# Altium schematic sheet IMX6ULL_CORE_sch5.SchDoc
size A4
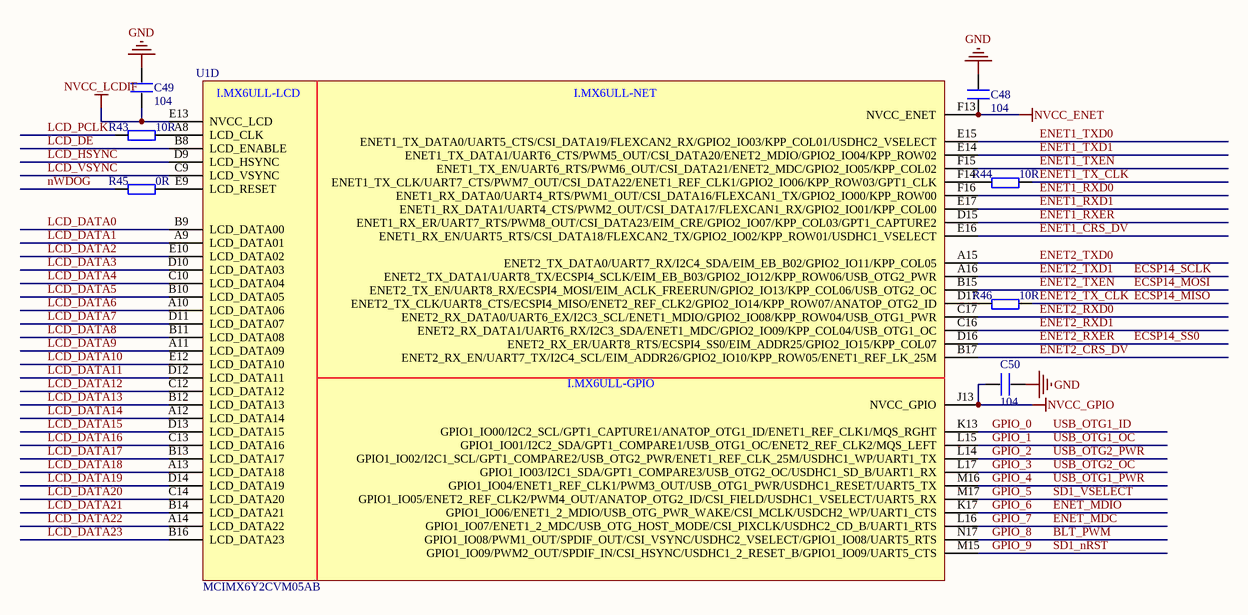
[diagram p0: IMX6ULL_CORE_sch5.SchDoc]

## Parts
C48  104  [C 0402]
C49  104  [C 0402]
C50  104  [C 0402]
R43  10R  [R 0402]
R44  10R  [R 0402]
R45  0R  [R 0402]
R46  10R  [R 0402]
U1  MCIMX6Y2CVM05AB  [BGA289C80P17X17_1400X1400X132]  (part D of 5)

## Nets
GND: C48.2 C49.2 C50.1
NVCC_ENET: C48.1 U1.F13(NVCC_ENET)
NVCC_GPIO: C50.2 U1.J13(NVCC_GPIO)
NVCC_LCDIF: C49.1 U1.E13(NVCC_LCD)
BLT_PWM: U1.N17(GPIO1_IO08/PWM1_OUT/SPDIF_OUT/CSI_VSYNC/USDHC2_VSELECT/GPIO1_IO08/UART5_RTS)  [also labelled GPIO_8]
ECSP14_MISO: R46.2  [also labelled ENET2_TX_CLK]
ECSP14_MOSI: U1.B15(ENET2_TX_EN/UART8_RX/ECSPI4_MOSI/EIM_ACLK_FREERUN/GPIO2_IO13/KPP_COL06/USB_OTG2_OC)  [also labelled ENET2_TXEN]
ECSP14_SCLK: U1.A16(ENET2_TX_DATA1/UART8_TX/ECSPI4_SCLK/EIM_EB_B03/GPIO2_IO12/KPP_ROW06/USB_OTG2_PWR)  [also labelled ENET2_TXD1]
ECSP14_SS0: U1.D16(ENET2_RX_ER/UART8_RTS/ECSPI4_SS0/EIM_ADDR25/GPIO2_IO15/KPP_COL07)  [also labelled ENET2_RXER]
ENET1_CRS_DV: U1.E16(ENET1_RX_EN/UART5_RTS/CSI_DATA18/FLEXCAN2_TX/GPIO2_IO02/KPP_ROW01/USDHC1_VSELECT)
ENET1_RXD0: U1.F16(ENET1_RX_DATA0/UART4_RTS/PWM1_OUT/CSI_DATA16/FLEXCAN1_TX/GPIO2_IO00/KPP_ROW00)
ENET1_RXD1: U1.E17(ENET1_RX_DATA1/UART4_CTS/PWM2_OUT/CSI_DATA17/FLEXCAN1_RX/GPIO2_IO01/KPP_COL00)
ENET1_RXER: U1.D15(ENET1_RX_ER/UART7_RTS/PWM8_OUT/CSI_DATA23/EIM_CRE/GPIO2_IO07/KPP_COL03/GPT1_CAPTURE2)
ENET1_TX_CLK: R44.2
ENET1_TXD0: U1.E15(ENET1_TX_DATA0/UART5_CTS/CSI_DATA19/FLEXCAN2_RX/GPIO2_IO03/KPP_COL01/USDHC2_VSELECT)
ENET1_TXD1: U1.E14(ENET1_TX_DATA1/UART6_CTS/PWM5_OUT/CSI_DATA20/ENET2_MDIO/GPIO2_IO04/KPP_ROW02)
ENET1_TXEN: U1.F15(ENET1_TX_EN/UART6_RTS/PWM6_OUT/CSI_DATA21/ENET2_MDC/GPIO2_IO05/KPP_COL02)
ENET2_CRS_DV: U1.B17(ENET2_RX_EN/UART7_TX/I2C4_SCL/EIM_ADDR26/GPIO2_IO10/KPP_ROW05/ENET1_REF_LK_25M)
ENET2_RXD0: U1.C17(ENET2_RX_DATA0/UART6_EX/I2C3_SCL/ENET1_MDIO/GPIO2_IO08/KPP_ROW04/USB_OTG1_PWR)
ENET2_RXD1: U1.C16(ENET2_RX_DATA1/UART6_RX/I2C3_SDA/ENET1_MDC/GPIO2_IO09/KPP_COL04/USB_OTG1_OC)
ENET2_TXD0: U1.A15(ENET2_TX_DATA0/UART7_RX/I2C4_SDA/EIM_EB_B02/GPIO2_IO11/KPP_COL05)
ENET_MDC: U1.L16(GPIO1_IO07/ENET1_2_MDC/USB_OTG_HOST_MODE/CSI_PIXCLK/USDHC2_CD_B/UART1_RTS)  [also labelled GPIO_7]
ENET_MDIO: U1.K17(GPIO1_IO06/ENET1_2_MDIO/USB_OTG_PWR_WAKE/CSI_MCLK/USDCH2_WP/UART1_CTS)  [also labelled GPIO_6]
GPIO_0: U1.K13(GPIO1_IO00/I2C2_SCL/GPT1_CAPTURE1/ANATOP_OTG1_ID/ENET1_REF_CLK1/MQS_RGHT)  [also labelled USB_OTG1_ID]
GPIO_1: U1.L15(GPIO1_IO01/I2C2_SDA/GPT1_COMPARE1/USB_OTG1_OC/ENET2_REF_CLK2/MQS_LEFT)  [also labelled USB_OTG1_OC]
GPIO_2: U1.L14(GPIO1_IO02/I2C1_SCL/GPT1_COMPARE2/USB_OTG2_PWR/ENET1_REF_CLK_25M/USDHC1_WP/UART1_TX)  [also labelled USB_OTG2_PWR]
GPIO_3: U1.L17(GPIO1_IO03/I2C1_SDA/GPT1_COMPARE3/USB_OTG2_OC/USDHC1_SD_B/UART1_RX)  [also labelled USB_OTG2_OC]
GPIO_4: U1.M16(GPIO1_IO04/ENET1_REF_CLK1/PWM3_OUT/USB_OTG1_PWR/USDHC1_RESET/UART5_TX)  [also labelled USB_OTG1_PWR]
GPIO_5: U1.M17(GPIO1_IO05/ENET2_REF_CLK2/PWM4_OUT/ANATOP_OTG2_ID/CSI_FIELD/USDHC1_VSELECT/UART5_RX)  [also labelled SD1_VSELECT]
GPIO_9: U1.M15(GPIO1_IO09/PWM2_OUT/SPDIF_IN/CSI_HSYNC/USDHC1_2_RESET_B/GPIO1_IO09/UART5_CTS)  [also labelled SD1_nRST]
LCD_DATA0: U1.B9(LCD_DATA00)
LCD_DATA1: U1.A9(LCD_DATA01)
LCD_DATA2: U1.E10(LCD_DATA02)
LCD_DATA3: U1.D10(LCD_DATA03)
LCD_DATA4: U1.C10(LCD_DATA04)
LCD_DATA5: U1.B10(LCD_DATA05)
LCD_DATA6: U1.A10(LCD_DATA06)
LCD_DATA7: U1.D11(LCD_DATA07)
LCD_DATA8: U1.B11(LCD_DATA08)
LCD_DATA9: U1.A11(LCD_DATA09)
LCD_DATA10: U1.E12(LCD_DATA10)
LCD_DATA11: U1.D12(LCD_DATA11)
LCD_DATA12: U1.C12(LCD_DATA12)
LCD_DATA13: U1.B12(LCD_DATA13)
LCD_DATA14: U1.A12(LCD_DATA14)
LCD_DATA15: U1.D13(LCD_DATA15)
LCD_DATA16: U1.C13(LCD_DATA16)
LCD_DATA17: U1.B13(LCD_DATA17)
LCD_DATA18: U1.A13(LCD_DATA18)
LCD_DATA19: U1.D14(LCD_DATA19)
LCD_DATA20: U1.C14(LCD_DATA20)
LCD_DATA21: U1.B14(LCD_DATA21)
LCD_DATA22: U1.A14(LCD_DATA22)
LCD_DATA23: U1.B16(LCD_DATA23)
LCD_DE: U1.B8(LCD_ENABLE)
LCD_HSYNC: U1.D9(LCD_HSYNC)
LCD_PCLK: R43.1
LCD_VSYNC: U1.C9(LCD_VSYNC)
nWDOG: R45.1
NetR43_2: R43.2 U1.A8(LCD_CLK)
NetR44_1: R44.1 U1.F14(ENET1_TX_CLK/UART7_CTS/PWM7_OUT/CSI_DATA22/ENET1_REF_CLK1/GPIO2_IO06/KPP_ROW03/GPT1_CLK)
NetR45_2: R45.2 U1.E9(LCD_RESET)
NetR46_1: R46.1 U1.D17(ENET2_TX_CLK/UART8_CTS/ECSPI4_MISO/ENET2_REF_CLK2/GPIO2_IO14/KPP_ROW07/ANATOP_OTG2_ID)

## Notes on the sheet
- (in symbol MCIMX6Y2CVM05AB, part D) I.MX6ULL-LCD; I.MX6ULL-NET; I.MX6ULL-GPIO

## Library data of the parts
C48-C50 = C
R43-R46 = R